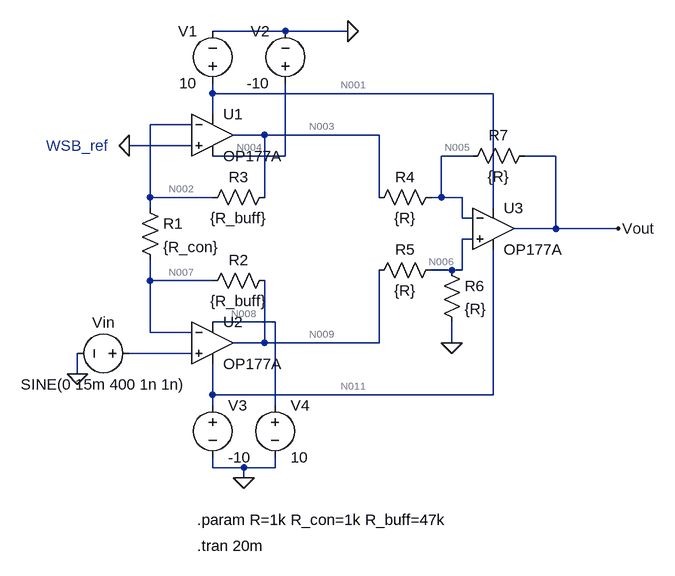
[diagram p0: schematic instrumentation_amp.asc]
instrumentation_amp.asc, the LTspice schematic file:
Version 4.1
SHEET 1 880 776
WIRE 256 -32 144 -32
WIRE 352 -32 256 -32
WIRE 144 64 144 48
WIRE 576 64 144 64
WIRE 144 96 144 64
WIRE 112 112 48 112
WIRE 224 128 176 128
WIRE 400 128 224 128
WIRE 112 144 16 144
WIRE 256 160 256 48
WIRE 256 160 144 160
WIRE 544 160 496 160
WIRE 672 160 624 160
WIRE 48 224 48 112
WIRE 144 224 48 224
WIRE 224 224 224 128
WIRE 400 224 400 128
WIRE 496 224 496 160
WIRE 496 224 480 224
WIRE 528 224 496 224
WIRE 48 240 48 224
WIRE 576 240 576 64
WIRE 528 256 528 224
WIRE 544 256 528 256
WIRE 672 272 672 160
WIRE 672 272 608 272
WIRE 768 272 672 272
WIRE 544 288 528 288
WIRE 512 336 480 336
WIRE 528 336 528 288
WIRE 528 336 512 336
WIRE 48 352 48 320
WIRE 144 352 48 352
WIRE 240 416 144 416
WIRE 48 432 48 352
WIRE 112 432 48 432
WIRE 224 448 224 352
WIRE 224 448 176 448
WIRE 400 448 400 336
WIRE 400 448 224 448
WIRE 512 448 512 416
WIRE 112 464 16 464
WIRE -64 496 -64 464
WIRE 144 528 144 480
WIRE 576 528 576 304
WIRE 576 528 144 528
WIRE 144 544 144 528
WIRE 240 544 240 416
WIRE 144 640 144 624
WIRE 192 640 144 640
WIRE 240 640 240 624
WIRE 240 640 192 640
WIRE 192 656 192 640
FLAG 512 448 0
FLAG 16 144 0
FLAG -64 496 0
FLAG 768 272 Vout
FLAG 352 -32 0
FLAG 192 656 0
SYMBOL OpAmps\\OP177A 144 64 R0
SYMATTR InstName U1
SYMBOL res 32 224 R0
SYMATTR InstName R1
SYMATTR Value {R_con}
SYMBOL OpAmps\\OP177A 144 384 R0
SYMATTR InstName U2
SYMBOL res 240 336 R90
WINDOW 0 0 56 VBottom 2
WINDOW 3 32 56 VTop 2
SYMATTR InstName R2
SYMATTR Value {R_buff}
SYMBOL res 240 208 R90
WINDOW 0 0 56 VBottom 2
WINDOW 3 32 56 VTop 2
SYMATTR InstName R3
SYMATTR Value {R_buff}
SYMBOL res 496 208 R90
WINDOW 0 0 56 VBottom 2
WINDOW 3 32 56 VTop 2
SYMATTR InstName R4
SYMATTR Value {R}
SYMBOL res 496 320 R90
WINDOW 0 0 56 VBottom 2
WINDOW 3 32 56 VTop 2
SYMATTR InstName R5
SYMATTR Value {R}
SYMBOL OpAmps\\OP177A 576 208 R0
SYMATTR InstName U3
SYMBOL res 496 320 R0
SYMATTR InstName R6
SYMATTR Value {R}
SYMBOL res 640 144 R90
WINDOW 0 0 56 VBottom 2
WINDOW 3 32 56 VTop 2
SYMATTR InstName R7
SYMATTR Value {R}
SYMBOL voltage 32 464 R90
WINDOW 0 -32 56 VBottom 2
WINDOW 3 32 56 VTop 2
WINDOW 123 0 0 Left 0
WINDOW 39 0 0 Left 0
SYMATTR InstName Vin
SYMATTR Value SINE(0 15m 400 1n 1n)
SYMBOL voltage 144 64 R180
WINDOW 0 24 96 Left 2
WINDOW 3 24 16 Left 2
WINDOW 123 0 0 Left 0
WINDOW 39 0 0 Left 0
SYMATTR InstName V1
SYMATTR Value 10
SYMBOL voltage 256 64 R180
WINDOW 0 24 96 Left 2
WINDOW 3 24 16 Left 2
WINDOW 123 0 0 Left 0
WINDOW 39 0 0 Left 0
SYMATTR InstName V2
SYMATTR Value -10
SYMBOL voltage 144 528 R0
WINDOW 123 0 0 Left 0
WINDOW 39 0 0 Left 0
SYMATTR InstName V3
SYMATTR Value -10
SYMBOL voltage 240 528 R0
WINDOW 123 0 0 Left 0
WINDOW 39 0 0 Left 0
SYMATTR InstName V4
SYMATTR Value 10
TEXT 120 720 Left 2 !.param R=1k R_con=1k R_buff=47k
TEXT 120 760 Left 2 !.tran 20m
TEXT -112 144 Left 2 ;WSB_ref

The netlist it stands for:
* instrumentation_amp.asc
X§U1 0 N002 N001 N004 N003 OP177A  ; pins In+ In- V+ V- OUT
R1 N002 N007 {R_con}
X§U2 N010 N007 N008 N011 N009 OP177A  ; pins In+ In- V+ V- OUT
R2 N009 N007 {R_buff}
R3 N003 N002 {R_buff}
R4 N005 N003 {R}
R5 N006 N009 {R}
X§U3 N006 N005 N001 N011 Vout OP177A  ; pins In+ In- V+ V- OUT
R6 N006 0 {R}
R7 Vout N005 {R}
Vin N010 0 SINE(0 15m 400 1n 1n)
V1 N001 0 10
V2 N004 0 -10
V3 N011 0 -10
V4 N008 0 10
.param R=1k R_con=1k R_buff=47k
.tran 20m
* WSB_ref
.backanno
.end

* Results of the author's LTspice run, read from the files saved beside the schematic
* Operating Point, zero values left out:
*   V(n001) = 10 V
*   V(n002) = 24.98 µV
*   V(n003) = 69.78 µV
*   V(n004) = -10 V
*   V(n005) = 59.24 µV
*   V(n006) = 34.27 µV
*   V(n007) = 24.98 µV
*   V(n008) = 10 V
*   V(n009) = 69.78 µV
*   V(n011) = -10 V
*   V(vout) = 49.66 µV
*   I(R2) = 953.3 pA
*   I(R3) = 953.3 pA
*   I(R4) = -10.54 nA
*   I(R5) = -35.51 nA
*   I(R6) = 34.27 nA
*   I(R7) = -9.585 nA
*   I(V1) = -3.15 mA
*   I(V2) = 1.575 mA
*   I(V3) = 3.15 mA
*   I(V4) = -1.575 mA
*   I(Vin) = -1.247 nA
*   Ix(u1:1) = 1.247 nA
*   Ix(u1:2) = 953.3 pA
*   Ix(u1:3) = 1.575 mA
*   Ix(u1:4) = -1.575 mA
*   Ix(u1:5) = -11.49 nA
*   Ix(u2:1) = 1.247 nA
*   Ix(u2:2) = 953.3 pA
*   Ix(u2:3) = 1.575 mA
*   Ix(u2:4) = -1.575 mA
*   Ix(u2:5) = -36.47 nA
*   Ix(u3:1) = 1.247 nA
*   Ix(u3:2) = 953.3 pA
*   Ix(u3:3) = 1.575 mA
*   Ix(u3:4) = -1.575 mA
*   Ix(u3:5) = 9.585 nA
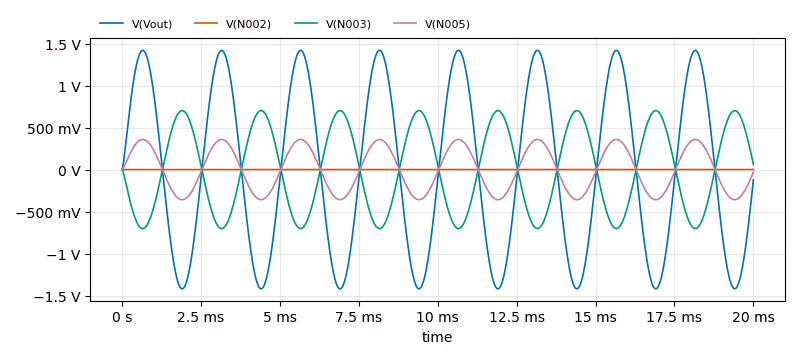
[diagram p1: Transient Analysis of instrumentation_amp.asc, plotted from the saved traces]
* Transient Analysis, 1 run:
*   V(Vout): min -1.42 V, max 1.42 V, average 246.7 µV, rms 1.004 V, last -119.7 mV
*   V(N002): min -640.5 µV, max 690.5 µV, average 23.87 µV, rms 470.1 µV, last 688.2 µV
*   V(N003): min -702.5 mV, max 702.7 mV, average -26.84 µV, rms 496.8 mV, last 58.8 mV
*   V(N005): min -358.7 mV, max 358.8 mV, average 109.4 µV, rms 253.7 mV, last -30.44 mV